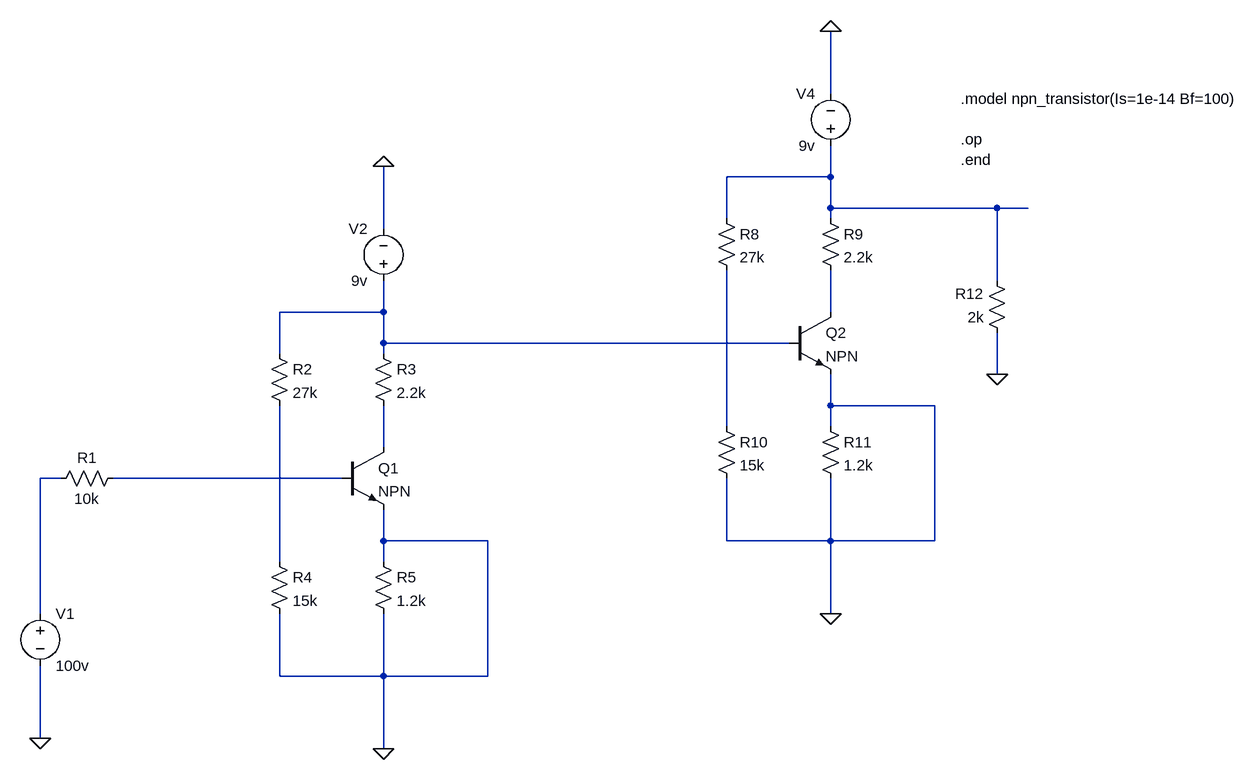
[diagram p0: schematic QUES4.8.asc]
QUES4.8.asc, the LTspice schematic file:
Version 4
SHEET 1 1800 680
WIRE 928 -432 928 -528
WIRE 928 -304 928 -352
WIRE 928 -304 768 -304
WIRE 928 -256 928 -304
WIRE 1184 -256 928 -256
WIRE 1232 -256 1184 -256
WIRE 768 -240 768 -304
WIRE 928 -240 928 -256
WIRE 240 -224 240 -320
WIRE 1184 -144 1184 -256
WIRE 240 -96 240 -144
WIRE 240 -96 80 -96
WIRE 928 -96 928 -160
WIRE 240 -48 240 -96
WIRE 864 -48 240 -48
WIRE 80 -32 80 -96
WIRE 240 -32 240 -48
WIRE 1184 0 1184 -64
WIRE 928 48 928 0
WIRE 1088 48 928 48
WIRE 768 80 768 -160
WIRE 928 80 928 48
WIRE 240 112 240 48
WIRE -256 160 -288 160
WIRE 176 160 -176 160
WIRE 240 256 240 208
WIRE 400 256 240 256
WIRE 768 256 768 160
WIRE 928 256 928 160
WIRE 928 256 768 256
WIRE 1088 256 1088 48
WIRE 1088 256 928 256
WIRE 80 288 80 48
WIRE 240 288 240 256
WIRE -288 368 -288 160
WIRE 928 368 928 256
WIRE 80 464 80 368
WIRE 240 464 240 368
WIRE 240 464 80 464
WIRE 400 464 400 256
WIRE 400 464 240 464
WIRE -288 560 -288 448
WIRE 240 576 240 464
FLAG 240 -320 0
FLAG 240 576 0
FLAG -288 560 0
FLAG 928 -528 0
FLAG 928 368 0
FLAG 1184 0 0
SYMBOL res -160 144 R90
WINDOW 0 0 56 VBottom 2
WINDOW 3 32 56 VTop 2
SYMATTR InstName R1
SYMATTR Value 10k
SYMBOL res 64 -48 R0
SYMATTR InstName R2
SYMATTR Value 27k
SYMBOL res 224 -48 R0
SYMATTR InstName R3
SYMATTR Value 2.2k
SYMBOL res 64 272 R0
SYMATTR InstName R4
SYMATTR Value 15k
SYMBOL res 224 272 R0
SYMATTR InstName R5
SYMATTR Value 1.2k
SYMBOL npn 176 112 R0
SYMATTR InstName Q1
SYMBOL voltage -288 352 R0
WINDOW 123 0 0 Left 2
WINDOW 39 0 0 Left 2
SYMATTR InstName V1
SYMATTR Value 100v
SYMBOL voltage 240 -128 R180
WINDOW 0 24 96 Left 2
WINDOW 3 24 16 Left 2
WINDOW 123 0 0 Left 2
WINDOW 39 0 0 Left 2
SYMATTR InstName V2
SYMATTR Value 9v
SYMBOL res 752 -256 R0
SYMATTR InstName R8
SYMATTR Value 27k
SYMBOL res 912 -256 R0
SYMATTR InstName R9
SYMATTR Value 2.2k
SYMBOL res 752 64 R0
SYMATTR InstName R10
SYMATTR Value 15k
SYMBOL res 912 64 R0
SYMATTR InstName R11
SYMATTR Value 1.2k
SYMBOL npn 864 -96 R0
SYMATTR InstName Q2
SYMBOL res 1200 -48 R180
WINDOW 0 36 76 Left 2
WINDOW 3 36 40 Left 2
SYMATTR InstName R12
SYMATTR Value 2k
SYMBOL voltage 928 -336 R180
WINDOW 0 24 96 Left 2
WINDOW 3 24 16 Left 2
WINDOW 123 0 0 Left 2
WINDOW 39 0 0 Left 2
SYMATTR InstName V4
SYMATTR Value 9v
TEXT 1128 -424 Left 2 !.model npn_transistor(Is=1e-14 Bf=100)\n \n.op\n.end

The netlist it stands for:
* QUES4.8.asc
R1 N007 N006 10k
R2 N002 N008 27k
R3 N002 N005 2.2k
R4 N008 0 15k
R5 0 0 1.2k
Q1 N005 N007 0 0 NPN
V1 N006 0 100v
V2 N002 0 9v
R8 N001 N004 27k
R9 N001 N003 2.2k
R10 N004 0 15k
R11 0 0 1.2k
Q2 N003 N002 0 0 NPN
R12 0 N001 2k
V4 N001 0 9v
.model NPN NPN
.model PNP PNP
.lib standard.bjt
.model npn_transistor(Is=1e-14 Bf=100)
.op
.end
.backanno
.end